# Altium schematic sheet VSupply3.SchDoc: Voltage Supply Shchematic
size A; DrawnBy: Enrique Morell; DocumentNumber: 8; Revision: v0.1; SheetNumber: 8; SheetTotal: 9
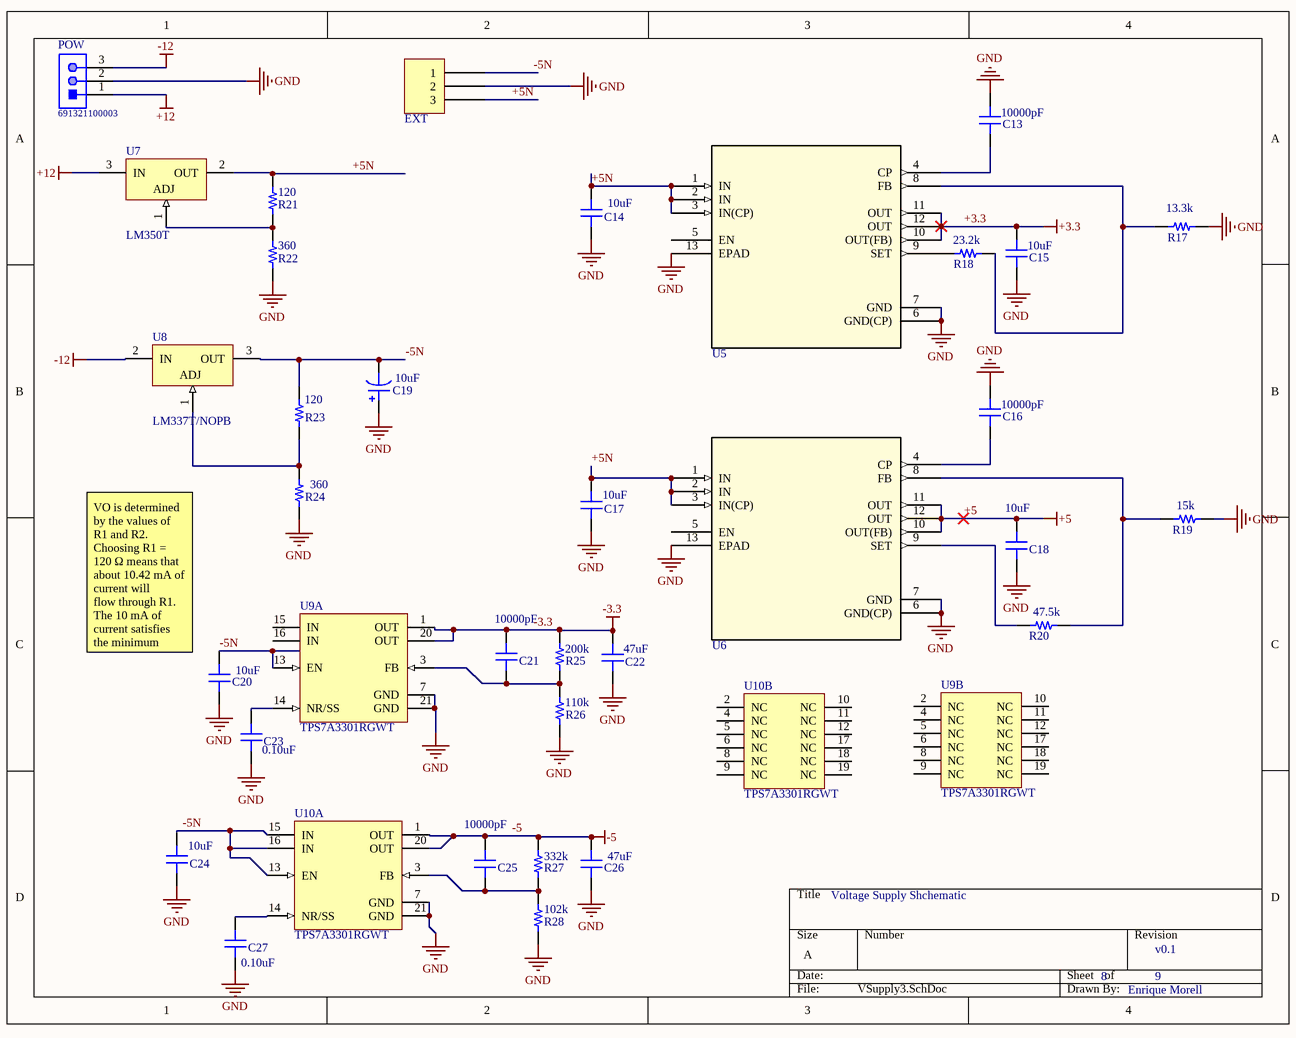
[diagram p0: VSupply3.SchDoc]

## Parts
C13  10000pF  [CAP 0402/1005]
C14  10uF  [CAP 1210/3225 - 2.8MM]
C15  10uF  [CAP 1210/3225 - 2.8MM]
C16  10000pF  [CAP 0402/1005]
C17  10uF  [CAP 1210/3225 - 2.8MM]
C18  10uF  [CAP 1210/3225 - 2.8MM]
C19  10uF  [CAP POL 2917/7343]
C20  10uF  [CAP 1210/3225 - 2.8MM]
C21  10000pF  [CAP 0402/1005]
C22  47uF  [CAP 1206/3216]
C23  0.10uF  [CAP 0402/1005]
C24  10uF  [CAP 1210/3225 - 2.8MM]
C25  10000pF  [CAP 0402/1005]
C26  47uF  [CAP 1206/3216]
C27  0.10uF  [CAP 0402/1005]
EXT  0022272031  [MOLEX KK 0022272031]  (value not drawn)
POW  691321100003  [691321100003]
R17  13.3k  [RES 0402/1005]
R18  23.2k  [RES 0402/1005]
R19  15k  [RES 0402/1005]
R20  47.5k  [RES 0402/1005]
R21  120  [RES 0402/1005]
R22  360  [RES 0402/1005]
R23  120  [RES 0402/1005]
R24  360  [RES 0402/1005]
R25  200k  [RES 0402/1005]
R26  110k  [RES 0402/1005]
R27  332k  [RES 0402/1005]
R28  102k  [RES 0402/1005]
U5  LP38798SDE-ADJ/NOPB  [TI WSON-12 DNT]  (value not drawn)
U6  LP38798SDE-ADJ/NOPB  [TI WSON-12 DNT]  (value not drawn)
U7  LM350T  [NDE0003A]
U8  LM337T/NOPB  [NDE0003A]
U9  TPS7A3301RGWT  [RGW0020A_V]  (parts A,B of 2)
U10  TPS7A3301RGWT  [RGW0020A_V]  (parts A,B of 2)

## Nets
+3.3: C15.2 U5.10(OUT(FB)) U5.11(OUT) U5.12(OUT)
+5: C18.2 U6.10(OUT(FB)) U6.11(OUT) U6.12(OUT)
+12: POW.1 U7.3(IN)
-3.3: C21.1 C22.2 R25.2 U9.1(OUT) U9.20(OUT)
-5: C25.1 C26.2 R27.2 U10.1(OUT) U10.20(OUT)
-12: POW.3 U8.2(IN)
GND: C13.2 C14.1 C15.1 C16.2 C17.1 C18.1 C19.1 C20.1 C22.1 C23.1 C24.1 C26.1 C27.1 EXT.2 POW.2 R17.2 R19.2 R22.1 R24.1 R26.1 R28.1 U5.6(GND(CP)) U5.7(GND) U5.13(EPAD) U6.6(GND(CP)) U6.7(GND) U6.13(EPAD) U9.7(GND) U9.21(GND) U10.7(GND) U10.21(GND)
+5N: C14.2 C17.2 EXT.3 R21.2 U5.1(IN) U5.2(IN) U5.3(IN(CP)) U6.1(IN) U6.2(IN) U6.3(IN(CP)) U7.2(OUT)
-5N: C19.2 C20.2 C24.2 EXT.1 R23.2 U8.3(OUT) U9.13(EN) U10.13(EN) U10.15(IN) U10.16(IN)
NetC13_1: C13.1 U5.4(CP)
NetC16_1: C16.1 U6.4(CP)
NetC21_2: C21.2 R25.1 R26.2 U9.3(FB)
NetC23_2: C23.2 U9.14(NR/SS)
NetC25_2: C25.2 R27.1 R28.2 U10.3(FB)
NetC27_2: C27.2 U10.14(NR/SS)
NetR17_1: R17.1 R18.2 U5.8(FB)
NetR18_1: R18.1 U5.9(SET)
NetR19_1: R19.1 R20.2 U6.8(FB)
NetR20_1: R20.1 U6.9(SET)
NetR21_1: R21.1 R22.2 U7.1(ADJ)
NetR23_1: R23.1 R24.2 U8.1(ADJ)

Not connected (* = marked no-connect by the designer): U5 5(EN); U6 5(EN); U9 2(NC) 4(NC) 5(NC) 6(NC) 8(NC) 9(NC) 10(NC) 11(NC) 12(NC) 15(IN) 16(IN) 17(NC) 18(NC) 19(NC); U10 2(NC) 4(NC) 5(NC) 6(NC) 8(NC) 9(NC) 10(NC) 11(NC) 12(NC) 17(NC) 18(NC) 19(NC)

## Notes on the sheet
- (near C20) VO is determined by the values of R1 and R2. Choosing R1 = 120 Ω means that about 10.42 mA of current will
  flow through R1. The 10 mA of current satisfies the minimum operating current and renders IREF negligible.
  Since the current is coming from ground, the same amount of current will flow through R2. Therefore, the size of
  R2 will be the dominant factor in adjusting VO. The relationship between R1, R2, and VO is as follows:
  where VO is the output in volts.

## Library data of the parts
C13 C16 C21 C25 = C0402C103J4RACTU: CAP CER 10000PF 16V X7R 0402; Manufacturer: Kemet; TemperatureRange: -55C ~ 125C; Tolerance: 5%; Value: 10000pF; Part Number: C0402C103J4RACTU; PartId: 12588; Supplier 1: Digi-Key; Supplier Part Number 1: 399-1039-2-ND; ComponentLink1Description: Datasheet; ComponentLink1URL: http://www.kemet.com/docfinder?Partnumber=C0402C103J4RACTU; ComponentLink2Description: Digi-Key Listing; ComponentLink2URL: https://www.digikey.com/product-detail/en/kemet/C0402C103J4RACTU/399-1039-2-ND/411041; TemperatureCoefficient: X7R; Voltage: 16V; Price: 0.0784; Device Package: 0402 (1005 Metric)
C14 C15 C17 C18 C20 C24 = CL32B106KAJNNNE: CAP CER 10UF 25V X7R 1210; Manufacturer: Samsung Electro-Mechanics America, Inc.; TemperatureRange: -55C ~ 125C; Tolerance: 10%; Value: 10uF; Part Number: CL32B106KAJNNNE; PartId: 19187; Supplier 1: Digi-Key; Supplier Part Number 1: 1276-1807-2-ND; ComponentLink1Description: Datasheet; ComponentLink1URL: http://www.samsungsem.com/kr/front/downloadcms.do?path=/kr/support/product-search/mlcc/__icsFiles/afieldfile/2014/11/05&fileName=C_CL32B106KAJNNNE.pdf; ComponentLink2Description: Digi-Key Listing; ComponentLink2URL: https://www.digikey.com/product-detail/en/samsung-electro-mechanics-america-inc/CL32B106KAJNNNE/1276-1807-2-ND/3887465; TemperatureCoefficient: X7R; Voltage: 25V; Price: 0.1715; Device Package: 1210 (3225 Metric)
C19 = 293D106X0035D2TE3: CAP TANT 10UF 35V 20% 2917; Manufacturer: Vishay Sprague; TemperatureRange: -55C ~ 125C; Type: General Purpose; Value: 10uF; Part Number: 293D106X0035D2TE3; PartId: 6869; Supplier 1: Digi-Key; Supplier Part Number 1: 718-1046-2-ND; ComponentLink1Description: Datasheet; ComponentLink1URL: http://www.vishay.com/docs/40002/293d.pdf; ComponentLink2Description: Digi-Key listing; ComponentLink2URL: http://digikey.com/product-detail/en/293D106X0035D2TE3/718-1046-2-ND/1559398; Tolerance: 20%; Voltage: 35V; Price: 0.3563; Device Package: 2917 (7343 Metric)
C22 C26 = C3216X5R1E476M160AC: CAP CER 47UF 25V X5R 1206; Manufacturer: TDK Corporation; TemperatureRange: -55C ~ 85C; Tolerance: 20%; Value: 47uF; Part Number: C3216X5R1E476M160AC; PartId: 15844; Supplier 1: Digi-Key; Supplier Part Number 1: 445-8047-2-ND; ComponentLink1Description: Datasheet; ComponentLink1URL: https://product.tdk.com/info/en/catalog/datasheets/mlcc_commercial_general_en.pdf; ComponentLink2Description: Digi-Key Listing; ComponentLink2URL: https://www.digikey.com/product-detail/en/tdk-corporation/C3216X5R1E476M160AC/445-8047-2-ND/2792260; TemperatureCoefficient: X5R; Voltage: 25V; Price: 0.4883; Device Package: 1206 (3216 Metric)
C23 C27 = GRM155R71C104JA88D: CAP CER 0.1UF 16V X7R 0402; Manufacturer: Murata Electronics North America; TemperatureRange: -55C ~ 125C; Tolerance: 5%; Value: 0.10uF; Part Number: GRM155R71C104JA88D; PartId: 12366; Supplier 1: Digi-Key; Supplier Part Number 1: 490-6327-2-ND; ComponentLink1Description: Datasheet; ComponentLink1URL: http://www.murata.com/~/media/webrenewal/support/library/catalog/products/capacitor/mlcc/c02e.pdf; ComponentLink2Description: Digi-Key Listing; ComponentLink2URL: https://www.digikey.com/product-detail/en/murata-electronics-north-america/GRM155R71C104JA88D/490-6327-2-ND/2610891; TemperatureCoefficient: X7R; Voltage: 16V; Price: 0.0046; Device Package: 0402 (1005 Metric)
EXT = 0022272031: CONN HEADER 3POS .100 VERT TIN; Manufacturer: Molex, LLC; Pitch: 0.100" (2.54mm); Number Of Positions: 3; Part Number: 0022272031; PartId: 9720; Supplier 1: Digi-Key; Supplier Part Number 1: WM4112-ND; ComponentLink1Description: Datasheet; ComponentLink1URL: http://www.molex.com/pdm_docs/sd/022272031_sd.pdf; ComponentLink2Description: Digi-Key Listing; ComponentLink2URL: http://www.digikey.com/product-search/en?keywords=22-27-2031; Price: 0.35; Type: Header, Unshrouded; Contact Finish: Tin; Fastening Type: Friction Lock; Number Of Rows: 1; Colour: Natural; Series: KK 6410
POW = CMP-1502-01784-1: Serie 3211 - 3.50mm Vertical PCB Header WR-TBL, 3 pin; Manufacturer: Wurth Elektronik; Pin Number: 3; Gender: Male; Datasheet URL: http://katalog.we-online.de/em/datasheet/6913211000xx.pdf; Package Reference: 691321100003; Pitch: 3.50mm; Publisher: WurthElektronik; Part Number: 691321100003; Mounting Technology: THT; Packaging: Box; Manufacturer URL: http://www.we-online.de; Operating Temperature: -40to105degC
R17 = ERJ-2RKF1332X: RES SMD 13.3K OHM 1% 1/10W 0402; Manufacturer: Panasonic Electronic Components; TemperatureRange: -55C ~ 155C; TemperatureCoefficient: 100ppm/C; PowerRating: 0.1W, 1/10W; Value: 13.3k; Part Number: ERJ-2RKF1332X; PartId: 334; Supplier 1: Digi-Key; Supplier Part Number 1: P13.3KLCT-ND; ComponentLink1Description: Datasheet; ComponentLink1URL: http://industrial.panasonic.com/www-cgi/jvcr13pz.cgi?E+PZ+3+AOA0002+ERJ2RKF1332X+7+WW; ComponentLink2Description: Digikey listing; ComponentLink2URL: http://digikey.com/product-detail/en/ERJ-2RKF1332X/P13.3KLTR-ND/192120; Tolerance: 1%; Price: 0.0043; Type: Thick Film; Device Package: 0402 (1005 Metric)
R18 = ERJ-2RKF2322X: RES SMD 23.2K OHM 1% 1/10W 0402; Manufacturer: Panasonic Electronic Components; TemperatureRange: -55C ~ 155C; TemperatureCoefficient: 100ppm/C; PowerRating: 0.1W, 1/10W; Value: 23.2k; Part Number: ERJ-2RKF2322X; PartId: 287; Supplier 1: Digi-Key; Supplier Part Number 1: P23.2KLTR-ND; ComponentLink1Description: Datasheet; ComponentLink1URL: http://industrial.panasonic.com/www-cgi/jvcr13pz.cgi?E+PZ+3+AOA0002+ERJ2RKF2322X+7+WW; ComponentLink2Description: Digikey listing; ComponentLink2URL: http://digikey.com/product-detail/en/ERJ-2RKF2322X/P23.2KLTR-ND/192235; Tolerance: 1%; Price: 0.0043; Type: Thick Film; Device Package: 0402 (1005 Metric)
R19 = ERJ-2RKF1502X: RES SMD 15K OHM 1% 1/10W 0402; Manufacturer: Panasonic Electronic Components; TemperatureRange: -55C ~ 155C; TemperatureCoefficient: 100ppm/C; PowerRating: 0.1W, 1/10W; Value: 15k; Part Number: ERJ-2RKF1502X; PartId: 12216; Supplier 1: Digi-Key; Supplier Part Number 1: P15.0KLCT-ND; ComponentLink1Description: Datasheet; ComponentLink1URL: http://industrial.panasonic.com/www-cgi/jvcr13pz.cgi?E+PZ+3+AOA0002+ERJ2RKF1502X+7+WW; ComponentLink2Description: Digi-Key Listing; ComponentLink2URL: https://www.digikey.com/product-detail/en/panasonic-electronic-components/ERJ-2RKF1502X/P15.0KLTR-ND/192143; Tolerance: 1%; Price: 0.0028; Device Package: 0402 (1005 Metric)
R20 = ERJ-2RKF4752X: RES SMD 47.5K OHM 1% 1/10W 0402; Manufacturer: Panasonic Electronic Components; TemperatureRange: -55C ~ 155C; TemperatureCoefficient: 100ppm/C; PowerRating: 0.1W, 1/10W; Value: 47.5k; Part Number: ERJ-2RKF4752X; PartId: 180; Supplier 1: Digi-Key; Supplier Part Number 1: P47.5KLTR-ND; ComponentLink1Description: Datasheet; ComponentLink1URL: http://industrial.panasonic.com/www-cgi/jvcr13pz.cgi?E+PZ+3+AOA0002+ERJ2RKF4752X+7+WW; ComponentLink2Description: Digikey listing; ComponentLink2URL: http://digikey.com/product-detail/en/ERJ-2RKF4752X/P47.5KLTR-ND/192375; Tolerance: 1%; Price: 0.0043; Type: Thick Film; Device Package: 0402 (1005 Metric)
R21 R23 = ERJ-2RKF1200X: RES SMD 120 OHM 1% 1/10W 0402; Manufacturer: Panasonic Electronic Components; TemperatureRange: -55C ~ 155C; TemperatureCoefficient: 100ppm/C; PowerRating: 0.1W, 1/10W; Value: 120; Part Number: ERJ-2RKF1200X; PartId: 12223; Supplier 1: Digi-Key; Supplier Part Number 1: P120LTR-ND; ComponentLink1Description: Datasheet; ComponentLink1URL: http://industrial.panasonic.com/www-cgi/jvcr13pz.cgi?E+PZ+3+AOA0002+ERJ2RKF1200X+7+WW; ComponentLink2Description: Digi-Key Listing; ComponentLink2URL: https://www.digikey.com/product-detail/en/panasonic-electronic-components/ERJ-2RKF1200X/P120LTR-ND/1746117; Tolerance: 1%; Price: 0.0028; Device Package: 0402 (1005 Metric)
R22 R24 = ERJ-2RKF3600X: RES SMD 360 OHM 1% 1/10W 0402; Manufacturer: Panasonic Electronic Components; TemperatureRange: -55C ~ 155C; TemperatureCoefficient: 100ppm/C; PowerRating: 0.1W, 1/10W; Value: 360; Part Number: ERJ-2RKF3600X; PartId: 445; Supplier 1: Digi-Key; Supplier Part Number 1: P360LTR-ND; ComponentLink1Description: Datasheet; ComponentLink1URL: http://industrial.panasonic.com/www-cgi/jvcr13pz.cgi?E+PZ+3+AOA0002+ERJ2RKF3600X+7+WW; ComponentLink2Description: Digikey listing; ComponentLink2URL: http://digikey.com/product-detail/en/ERJ-2RKF3600X/P360LTR-ND/1746200; Tolerance: 1%; Price: 0.0043; Type: Thick Film; Device Package: 0402 (1005 Metric)
R25 = ERJ-2RKF2003X: RES SMD 200K OHM 1% 1/10W 0402; Manufacturer: Panasonic Electronic Components; TemperatureRange: -55C ~ 155C; TemperatureCoefficient: 100ppm/C; PowerRating: 0.1W, 1/10W; Value: 200k; Part Number: ERJ-2RKF2003X; PartId: 17; Supplier 1: Digi-Key; Supplier Part Number 1: P200KLCT-ND; ComponentLink1Description: Datasheet; ComponentLink1URL: http://industrial.panasonic.com/www-cgi/jvcr13pz.cgi?E+PZ+3+AOA0002+ERJ2RKF2003X+7+WW; ComponentLink2Description: Digikey listing; ComponentLink2URL: http://digikey.com/product-detail/en/ERJ-2RKF2003X/P200KLTR-ND/192216; Tolerance: 1%; Price: 0.0043; Type: Thick Film; Device Package: 0402 (1005 Metric)
R26 = ERJ-2RKF1103X: RES SMD 110K OHM 1% 1/10W 0402; Manufacturer: Panasonic Electronic Components; TemperatureRange: -55C ~ 155C; TemperatureCoefficient: 100ppm/C; PowerRating: 0.1W, 1/10W; Value: 110k; Part Number: ERJ-2RKF1103X; PartId: 175; Supplier 1: Digi-Key; Supplier Part Number 1: P110KLTR-ND; ComponentLink1Description: Datasheet; ComponentLink1URL: http://industrial.panasonic.com/www-cgi/jvcr13pz.cgi?E+PZ+3+AOA0002+ERJ2RKF1103X+7+WW; ComponentLink2Description: Digikey listing; ComponentLink2URL: http://digikey.com/product-detail/en/ERJ-2RKF1103X/P110KLTR-ND/192097; Tolerance: 1%; Price: 0.0043; Type: Thick Film; Device Package: 0402 (1005 Metric)
R27 = ERJ-2RKF3323X: RES SMD 332K OHM 1% 1/10W 0402; Manufacturer: Panasonic Electronic Components; TemperatureRange: -55C ~ 155C; TemperatureCoefficient: 100ppm/C; PowerRating: 0.1W, 1/10W; Value: 332k; Part Number: ERJ-2RKF3323X; PartId: 225; Supplier 1: Digi-Key; Supplier Part Number 1: P332KLTR-ND; ComponentLink1Description: Datasheet; ComponentLink1URL: http://industrial.panasonic.com/www-cgi/jvcr13pz.cgi?E+PZ+3+AOA0002+ERJ2RKF3323X+7+WW; ComponentLink2Description: Digikey listing; ComponentLink2URL: http://digikey.com/product-detail/en/ERJ-2RKF3323X/P332KLTR-ND/192308; Tolerance: 1%; Price: 0.0043; Type: Thick Film; Device Package: 0402 (1005 Metric)
R28 = ERJ-2RKF1023X: RES SMD 102K OHM 1% 1/10W 0402; Manufacturer: Panasonic Electronic Components; TemperatureRange: -55C ~ 155C; TemperatureCoefficient: 100ppm/C; PowerRating: 0.1W, 1/10W; Value: 102k; Part Number: ERJ-2RKF1023X; PartId: 200; Supplier 1: Digi-Key; Supplier Part Number 1: P102KLTR-ND; ComponentLink1Description: Datasheet; ComponentLink1URL: http://industrial.panasonic.com/www-cgi/jvcr13pz.cgi?E+PZ+3+AOA0002+ERJ2RKF1023X+7+WW; ComponentLink2Description: Digikey listing; ComponentLink2URL: http://digikey.com/product-detail/en/ERJ-2RKF1023X/P102KLTR-ND/192083; Tolerance: 1%; Price: 0.0043; Type: Thick Film; Device Package: 0402 (1005 Metric)
U5 U6 = LP38798SDE-ADJ/NOPB: IC REG LIN POS ADJ 800MA 12WSON; Built_By: EMA_UL_Team; Vendor: Texas Instruments; Topology: Positive Adjustable; Manufacturer_Part_Number: LP38798SDE-ADJ/NOPB; Copyright: Copyright (C) 2018 Accelerated Designs. All rights reserved; RefDes: RefDes; Type: DEV; Value: Value; Part Number: LP38798SDE-ADJ/NOPB; PartId: 7965; Manufacturer: Texas Instruments; Supplier 1: Digi-Key; Supplier Part Number 1: 296-36225-1-ND; ComponentLink1Description: Datasheet; ComponentLink1URL: http://www.ti.com/lit/ds/symlink/lp38798.pdf; ComponentLink2Description: Digi-Key Listing; ComponentLink2URL: https://www.digikey.com/product-detail/en/texas-instruments/LP38798SDE-ADJ-NOPB/296-36225-1-ND/4240231; Price: 3.59; Device Package: 12-WSON (4x4)
U7 = CMP-0062-02498-3: 3-Amp Adjustable Regulator, 3-pin TO-220; Manufacturer: Texas Instruments; CompType: LDO IC; PowerWise: N; PackageTopMarking: NSUZXYTTE#*LM350T P+; PackageDescription: TO-220, Molded, 3 Lead, Straight; ComponentLink1URL: http://www.ti.com/general/docs/lit/getliterature.tsp?genericPartNumber=LM350-N&fileType=pdf; PinCount: 3; PackageReference: NDE0003A; RoHS: N; ComponentLink1Description: Datasheet URL
U8 = CMP-0062-02479-3: 3-Terminal Adjustable Negative Regulator, 3-pin TO-220, Pb-Free; Manufacturer: Texas Instruments; CompType: LDO IC; PowerWise: N; PackageTopMarking: NSUZXYTTE#*LM337T P+; PinCount: 3; RoHS: Y; ComponentLink1Description: Datasheet URL; ComponentLink1URL: http://www.ti.com/general/docs/lit/getliterature.tsp?genericPartNumber=LM337-N&fileType=pdf; PackageReference: NDE0003A; PackageDescription: TO-220, Molded, 3 Lead, Straight
U9 U10 = CMP-0395-01390-2: Single Output High PSRR LDO, 1 A, Adjustable -1.18 to -33 V Output, -3 to -36 V Input, with Ultra-Low Noise, 20-pin VQFN (RGW), -40 to 125 degC, Green (RoHS & no Sb/Br); Manufacturer: Texas Instruments; Iq(Typ)(mA): 0.21; Accuracy(%): 1.5; Iout(Max)(A): 1; SubFamily: Single Channel LDO; Vdo(Typ)(mV): 290; Vin(Max)(V): -36; ComponentLink3URL: http://www.ti.com/litv/pdf/mpqf122b; ComponentLink3Description: Package Specification; Code_JEDEC: MO-220; ComponentLink2Description: Datasheet; ComponentLink2URL: http://www.ti.com/general/docs/lit/getliterature.tsp?genericPartNumber=TPS7A3301&fileType=pdf; Vout Adj(Min)(V): -1.18; PackageDescription: 20-Pin Plastic Quad Flat No-Pin, 5 x 5 mm Body, 0.65 mm Pitch, 3.15 x 3.15 mm Exposed Pad; ComponentLink1URL: http://www.ti.com/; ComponentLink1Description: Manufacturer URL; Eco-Plan: Green (RoHS & no Sb/Br); PackageReference: RGW0020A; PartNumber: TPS7A3301RGWT; DatasheetVersion: SBVS169B; Vin(Min)(V): -3; Mounting Technology: Surface Mount; Vout Adj(Max)(V): -33